# Altium schematic sheet gtn650xi.SchDoc
size A2; SheetNumber: 3; SheetTotal: 17
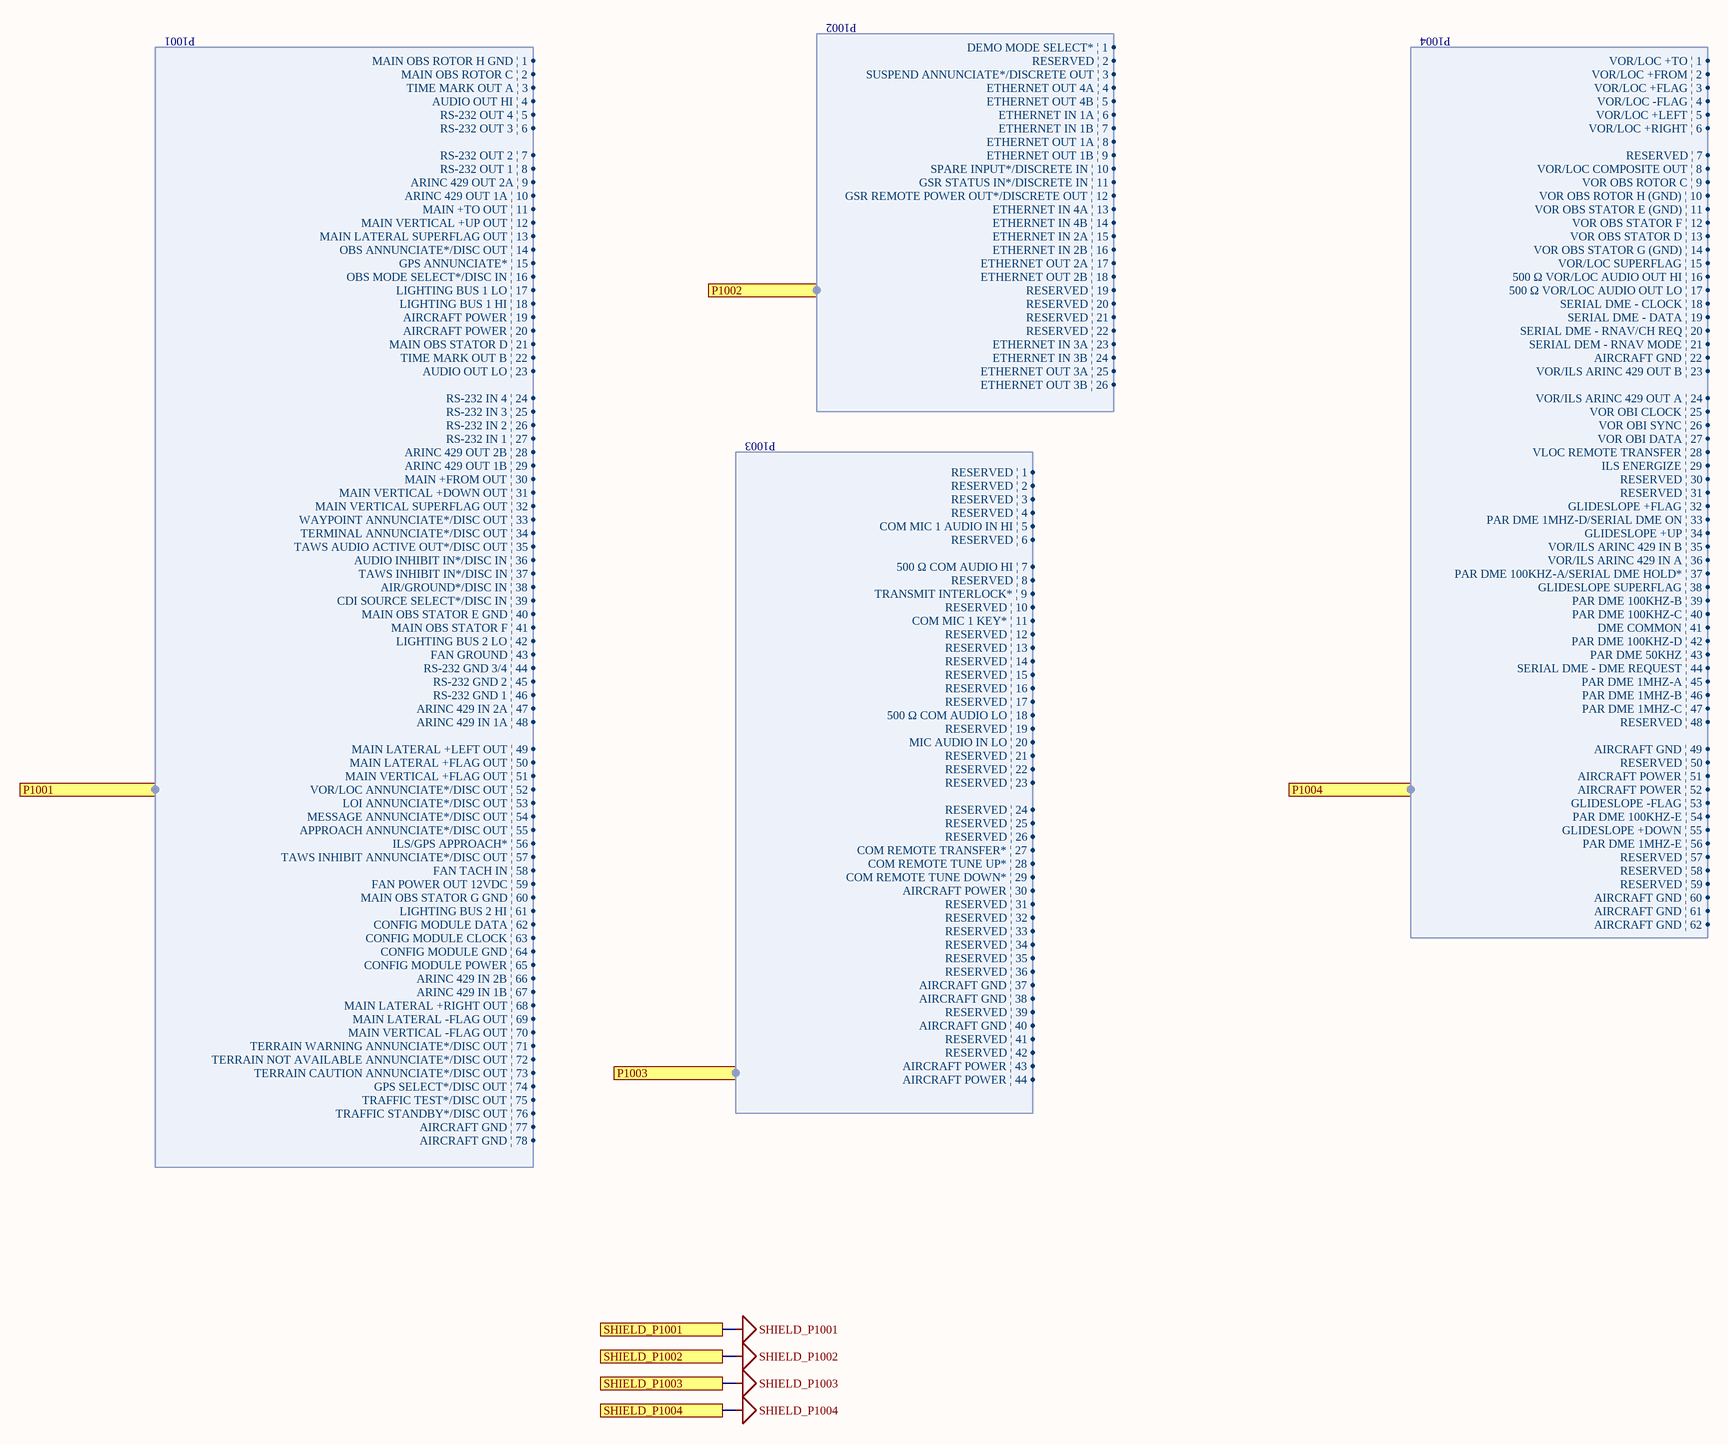
[diagram p0: gtn650xi.SchDoc]

## Ports
P1001 (harness P1001), P1002 (harness P1002), P1003 (harness P1003), P1004 (harness P1004), SHIELD_P1001, SHIELD_P1002, SHIELD_P1003, SHIELD_P1004

## Harnesses
P1001: MAIN OBS ROTOR H GND | 1, MAIN OBS ROTOR C | 2, TIME MARK OUT A | 3, AUDIO OUT HI | 4, RS-232 OUT 4 | 5, RS-232 OUT 3 | 6, RS-232 OUT 2 | 7, RS-232 OUT 1 | 8, ARINC 429 OUT 2A | 9, ARINC 429 OUT 1A | 10, MAIN +TO OUT | 11, MAIN VERTICAL +UP OUT | 12, MAIN LATERAL SUPERFLAG OUT | 13, OBS ANNUNCIATE*/DISC OUT | 14, GPS ANNUNCIATE* | 15, OBS MODE SELECT*/DISC IN | 16, LIGHTING BUS 1 LO | 17, LIGHTING BUS 1 HI | 18, AIRCRAFT POWER | 19, AIRCRAFT POWER | 20, MAIN OBS STATOR D | 21, TIME MARK OUT B | 22, AUDIO OUT LO | 23, RS-232 IN 4 | 24, RS-232 IN 3 | 25, RS-232 IN 2 | 26, RS-232 IN 1 | 27, ARINC 429 OUT 2B | 28, ARINC 429 OUT 1B | 29, MAIN +FROM OUT | 30, MAIN VERTICAL +DOWN OUT | 31, MAIN VERTICAL SUPERFLAG OUT | 32, WAYPOINT ANNUNCIATE*/DISC OUT | 33, TERMINAL ANNUNCIATE*/DISC OUT | 34, TAWS AUDIO ACTIVE OUT*/DISC OUT | 35, AUDIO INHIBIT IN*/DISC IN | 36, TAWS INHIBIT IN*/DISC IN | 37, AIR/GROUND*/DISC IN | 38, CDI SOURCE SELECT*/DISC IN | 39, MAIN OBS STATOR E GND | 40, MAIN OBS STATOR F | 41, LIGHTING BUS 2 LO | 42, FAN GROUND | 43, RS-232 GND 3/4 | 44, RS-232 GND 2 | 45, RS-232 GND 1 | 46, ARINC 429 IN 2A | 47, ARINC 429 IN 1A | 48, MAIN LATERAL +LEFT OUT | 49, MAIN LATERAL +FLAG OUT | 50, MAIN VERTICAL +FLAG OUT | 51, VOR/LOC ANNUNCIATE*/DISC OUT | 52, LOI ANNUNCIATE*/DISC OUT | 53, MESSAGE ANNUNCIATE*/DISC OUT | 54, APPROACH ANNUNCIATE*/DISC OUT | 55, ILS/GPS APPROACH* | 56, TAWS INHIBIT ANNUNCIATE*/DISC OUT | 57, FAN TACH IN | 58, FAN POWER OUT 12VDC | 59, MAIN OBS STATOR G GND | 60, LIGHTING BUS 2 HI | 61, CONFIG MODULE DATA | 62, CONFIG MODULE CLOCK | 63, CONFIG MODULE GND | 64, CONFIG MODULE POWER | 65, ARINC 429 IN 2B | 66, ARINC 429 IN 1B | 67, MAIN LATERAL +RIGHT OUT | 68, MAIN LATERAL -FLAG OUT | 69, MAIN VERTICAL -FLAG OUT | 70, TERRAIN WARNING ANNUNCIATE*/DISC OUT | 71, TERRAIN NOT AVAILABLE ANNUNCIATE*/DISC OUT | 72, TERRAIN CAUTION ANNUNCIATE*/DISC OUT | 73, GPS SELECT*/DISC OUT | 74, TRAFFIC TEST*/DISC OUT | 75, TRAFFIC STANDBY*/DISC OUT | 76, AIRCRAFT GND | 77, AIRCRAFT GND | 78
P1002: DEMO MODE SELECT* | 1, RESERVED | 2, SUSPEND ANNUNCIATE*/DISCRETE OUT | 3, ETHERNET OUT 4A | 4, ETHERNET OUT 4B | 5, ETHERNET IN 1A | 6, ETHERNET IN 1B | 7, ETHERNET OUT 1A | 8, ETHERNET OUT 1B | 9, SPARE INPUT*/DISCRETE IN | 10, GSR STATUS IN*/DISCRETE IN | 11, GSR REMOTE POWER OUT*/DISCRETE OUT | 12, ETHERNET IN 4A | 13, ETHERNET IN 4B | 14, ETHERNET IN 2A | 15, ETHERNET IN 2B | 16, ETHERNET OUT 2A | 17, ETHERNET OUT 2B | 18, RESERVED | 19, RESERVED | 20, RESERVED | 21, RESERVED | 22, ETHERNET IN 3A | 23, ETHERNET IN 3B | 24, ETHERNET OUT 3A | 25, ETHERNET OUT 3B | 26
P1003: RESERVED | 1, RESERVED | 2, RESERVED | 3, RESERVED | 4, COM MIC 1 AUDIO IN HI | 5, RESERVED | 6, 500 Ω COM AUDIO HI | 7, RESERVED | 8, TRANSMIT INTERLOCK* | 9, RESERVED | 10, COM MIC 1 KEY* | 11, RESERVED | 12, RESERVED | 13, RESERVED | 14, RESERVED | 15, RESERVED | 16, RESERVED | 17, 500 Ω COM AUDIO LO | 18, RESERVED | 19, MIC AUDIO IN LO | 20, RESERVED | 21, RESERVED | 22, RESERVED | 23, RESERVED | 24, RESERVED | 25, RESERVED | 26, COM REMOTE TRANSFER* | 27, COM REMOTE TUNE UP* | 28, COM REMOTE TUNE DOWN* | 29, AIRCRAFT POWER | 30, RESERVED | 31, RESERVED | 32, RESERVED | 33, RESERVED | 34, RESERVED | 35, RESERVED | 36, AIRCRAFT GND | 37, AIRCRAFT GND | 38, RESERVED | 39, AIRCRAFT GND | 40, RESERVED | 41, RESERVED | 42, AIRCRAFT POWER | 43, AIRCRAFT POWER | 44
P1004: VOR/LOC +TO | 1, VOR/LOC +FROM | 2, VOR/LOC +FLAG | 3, VOR/LOC -FLAG | 4, VOR/LOC +LEFT | 5, VOR/LOC +RIGHT | 6, RESERVED | 7, VOR/LOC COMPOSITE OUT | 8, VOR OBS ROTOR C | 9, VOR OBS ROTOR H (GND) | 10, VOR OBS STATOR E (GND) | 11, VOR OBS STATOR F | 12, VOR OBS STATOR D | 13, VOR OBS STATOR G (GND) | 14, VOR/LOC SUPERFLAG | 15, 500 Ω VOR/LOC AUDIO OUT HI | 16, 500 Ω VOR/LOC AUDIO OUT LO | 17, SERIAL DME - CLOCK | 18, SERIAL DME - DATA | 19, SERIAL DME - RNAV/CH REQ | 20, SERIAL DEM - RNAV MODE | 21, AIRCRAFT GND | 22, VOR/ILS ARINC 429 OUT B | 23, VOR/ILS ARINC 429 OUT A | 24, VOR OBI CLOCK | 25, VOR OBI SYNC | 26, VOR OBI DATA | 27, VLOC REMOTE TRANSFER | 28, ILS ENERGIZE | 29, RESERVED | 30, RESERVED | 31, GLIDESLOPE +FLAG | 32, PAR DME 1MHZ-D/SERIAL DME ON | 33, GLIDESLOPE +UP | 34, VOR/ILS ARINC 429 IN B | 35, VOR/ILS ARINC 429 IN A | 36, PAR DME 100KHZ-A/SERIAL DME HOLD* | 37, GLIDESLOPE SUPERFLAG | 38, PAR DME 100KHZ-B | 39, PAR DME 100KHZ-C | 40, DME COMMON | 41, PAR DME 100KHZ-D | 42, PAR DME 50KHZ | 43, SERIAL DME - DME REQUEST | 44, PAR DME 1MHZ-A | 45, PAR DME 1MHZ-B | 46, PAR DME 1MHZ-C | 47, RESERVED | 48, AIRCRAFT GND | 49, RESERVED | 50, AIRCRAFT POWER | 51, AIRCRAFT POWER | 52, GLIDESLOPE -FLAG | 53, PAR DME 100KHZ-E | 54, GLIDESLOPE +DOWN | 55, PAR DME 1MHZ-E | 56, RESERVED | 57, RESERVED | 58, RESERVED | 59, AIRCRAFT GND | 60, AIRCRAFT GND | 61, AIRCRAFT GND | 62

## Nets
SHIELD_P1001: port SHIELD_P1001
SHIELD_P1002: port SHIELD_P1002
SHIELD_P1003: port SHIELD_P1003
SHIELD_P1004: port SHIELD_P1004